# EAGLE schematic OpenPneu_ver2 (EAGLE 9.6.2)
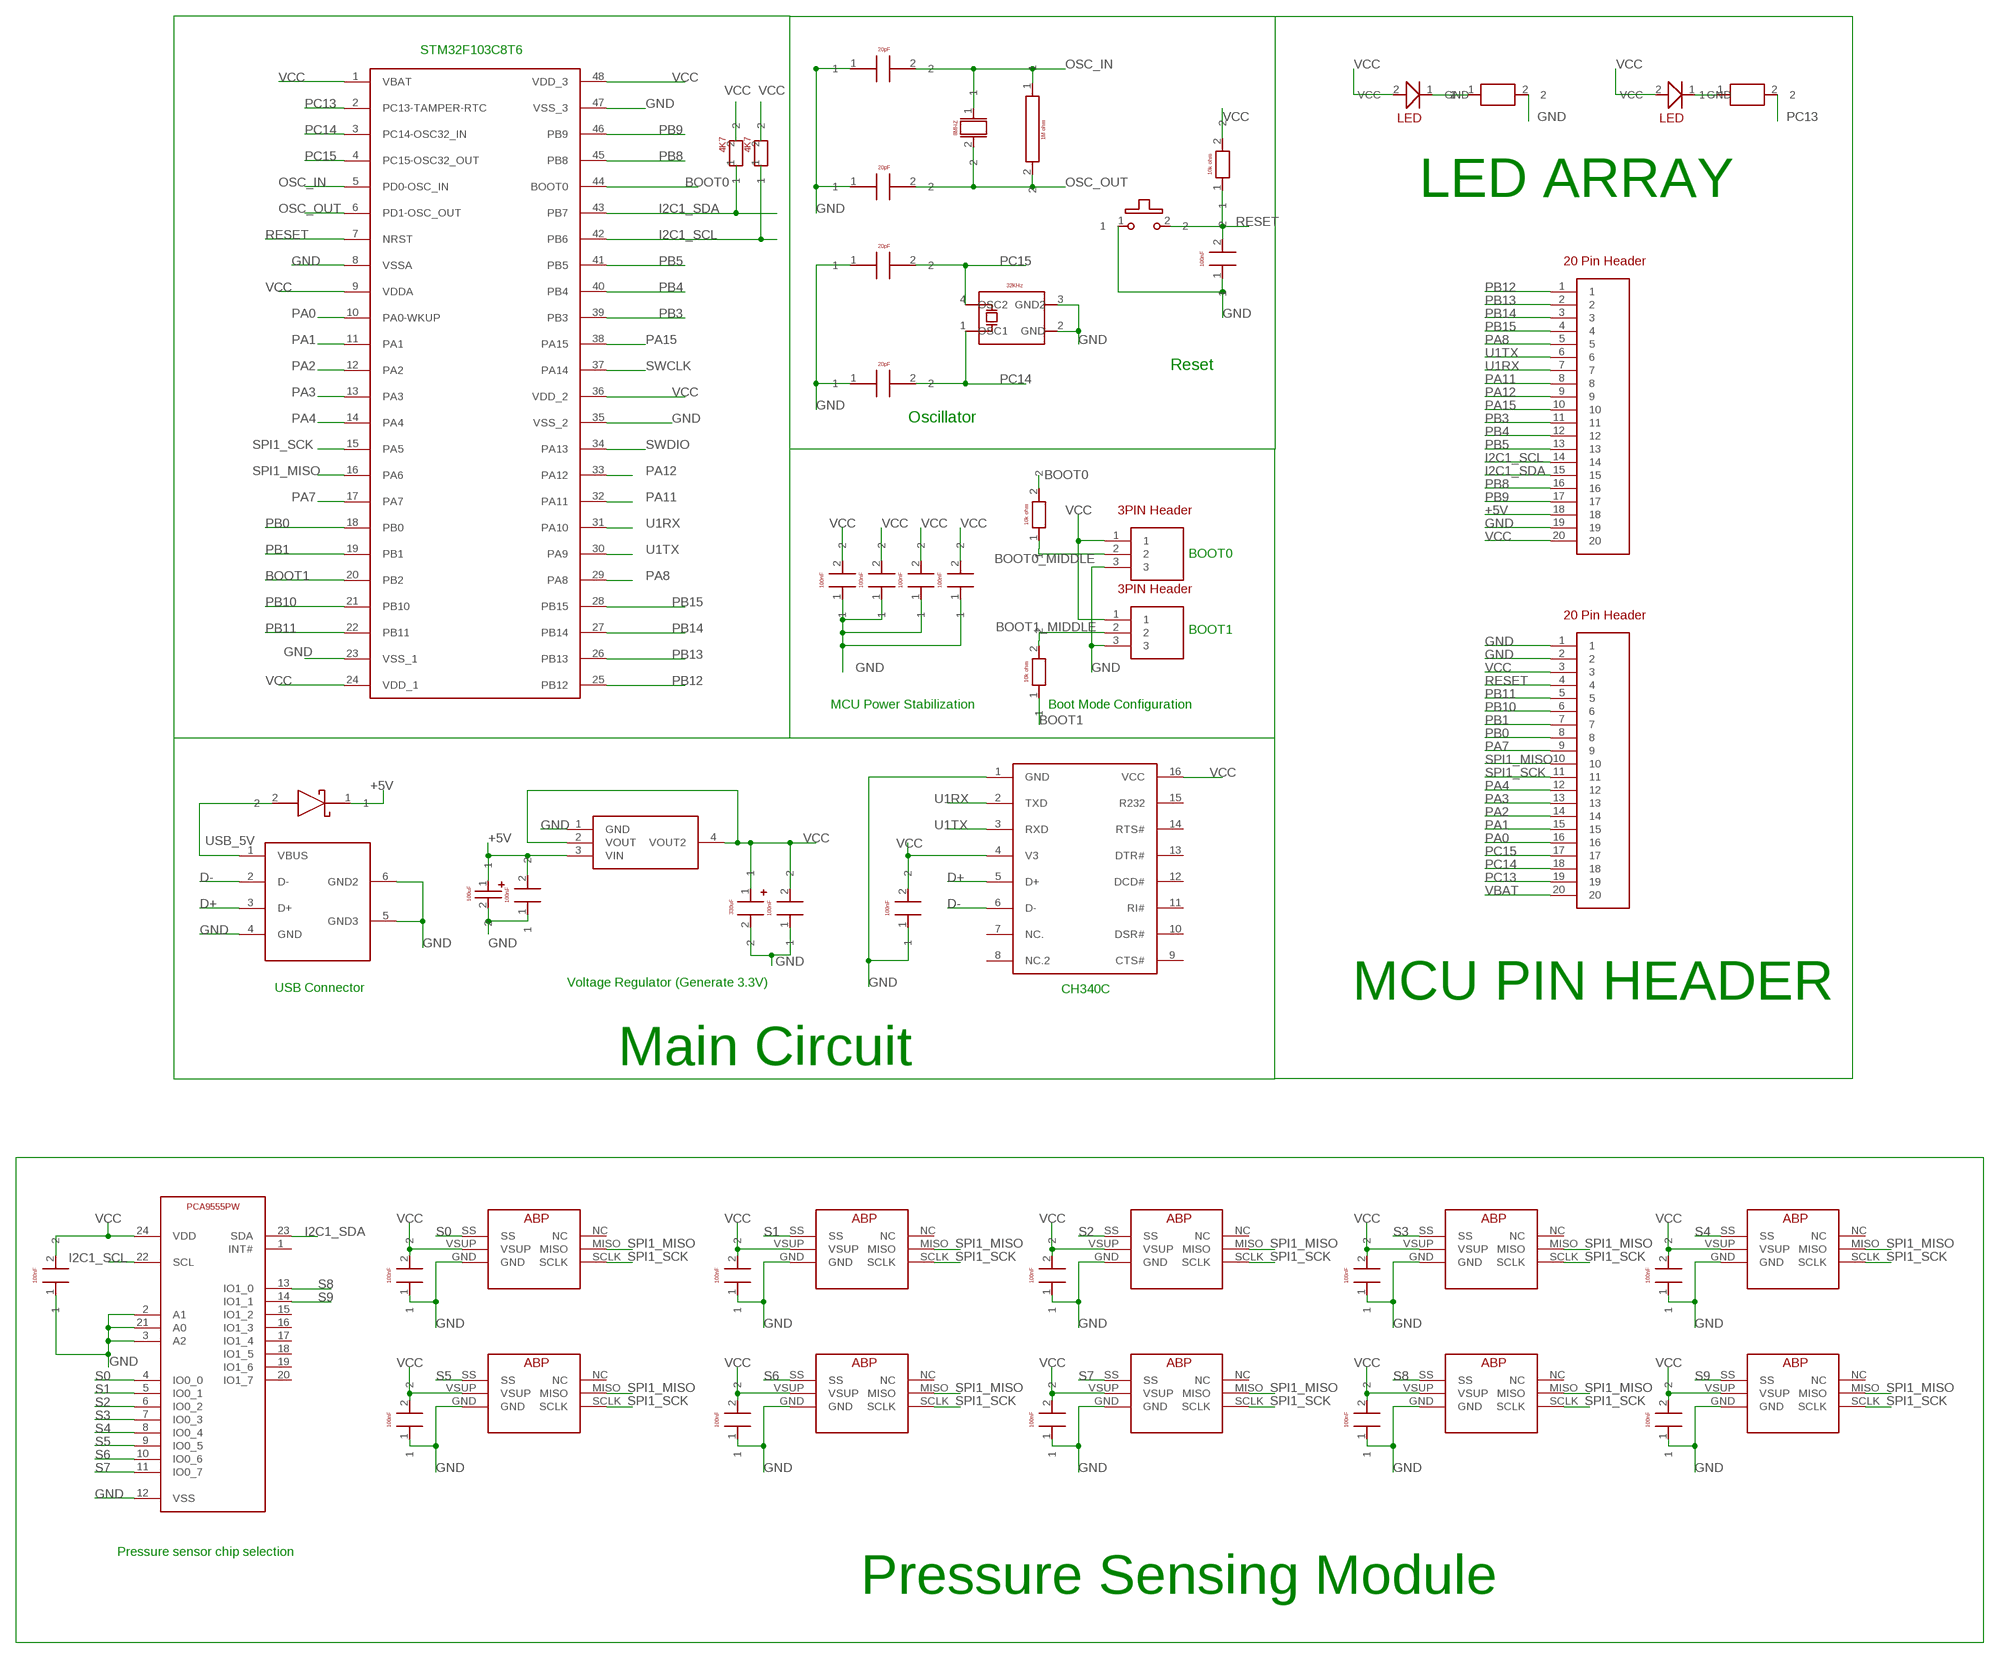
[diagram p0: schematic, sheet 1, part 1 of 3]
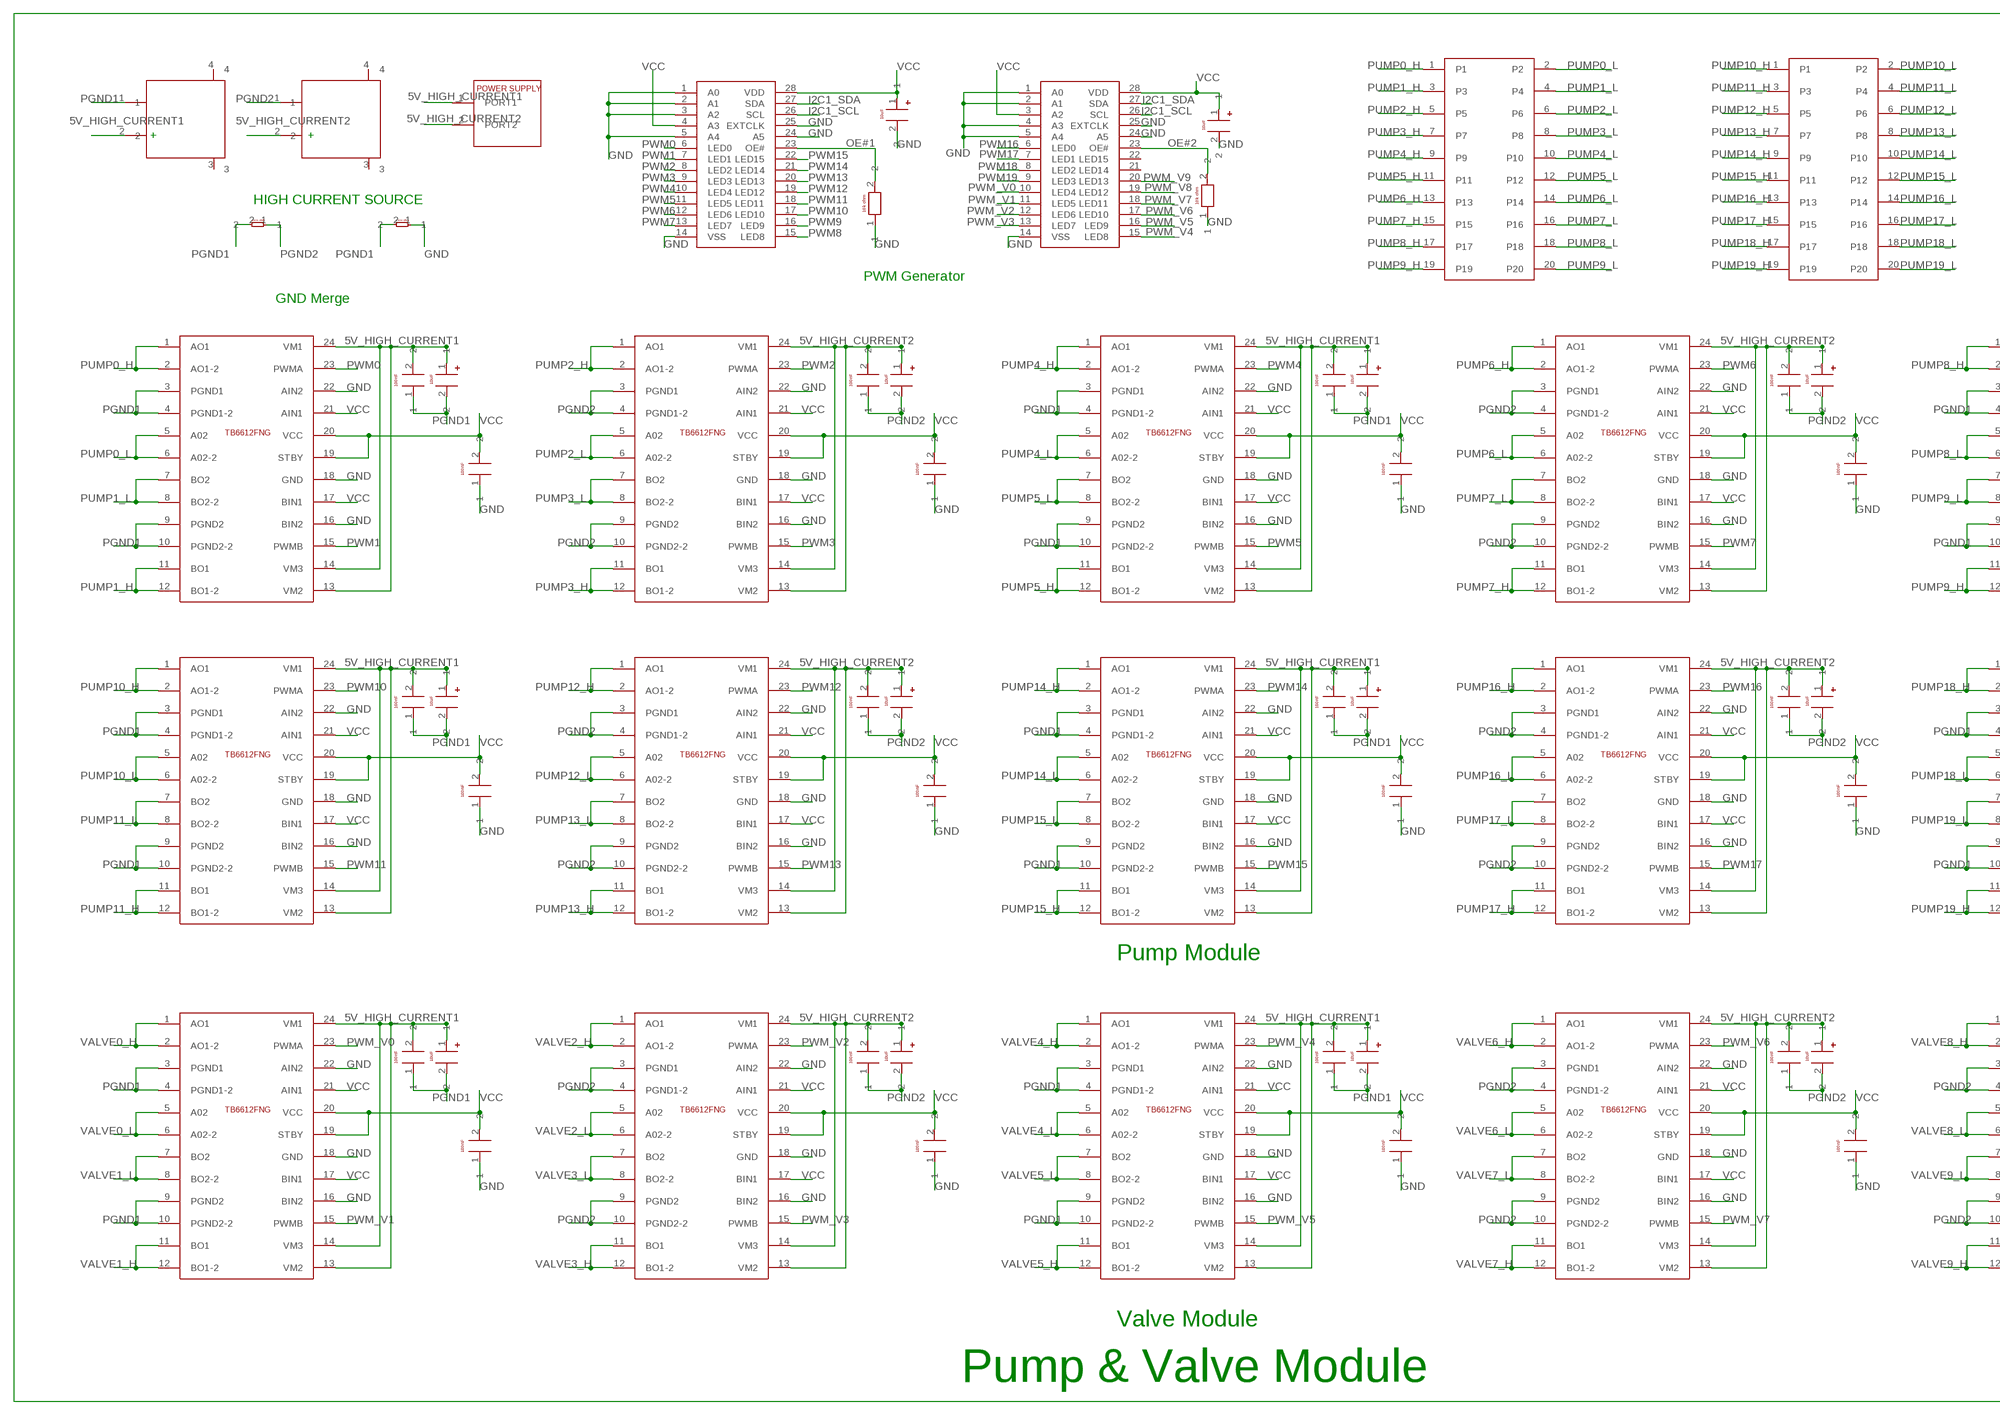
[diagram p1: schematic, sheet 1, part 2 of 3]
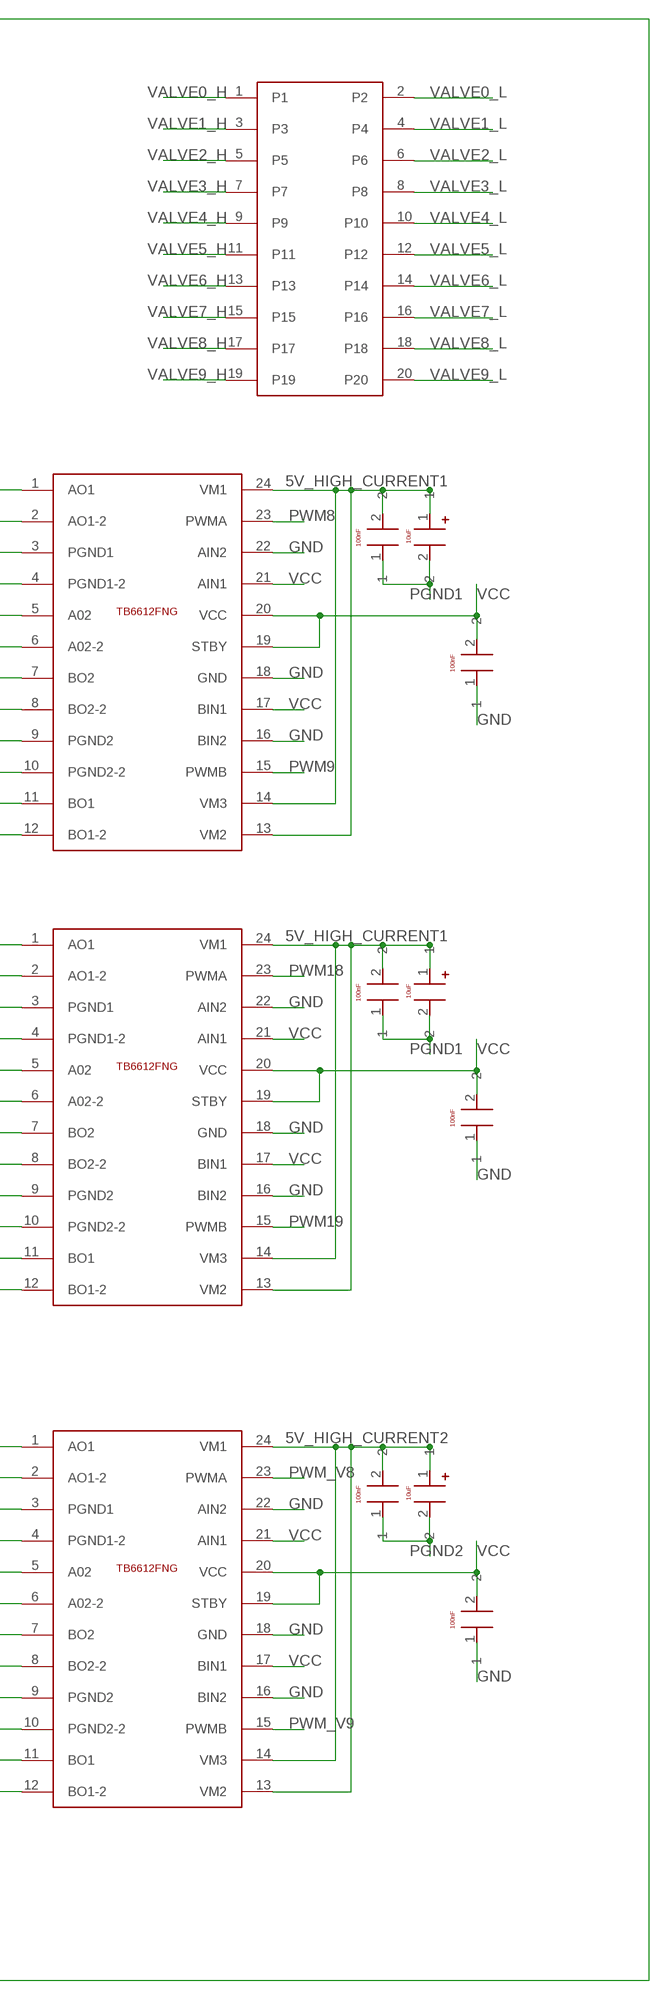
[diagram p2: schematic, sheet 1, part 3 of 3]

## Parts
J1  D01-9922046  [HDRV20W46P0X254_1X20_5090X254X]
J2  D01-9922046  [HDRV20W46P0X254_1X20_5090X254X]
U$1  STM32F103_DEVICE  [LQFP-48_L7.0-W7.0-P0.50-LS9.27PRIMARY]
U$2  8MHZ_DEVICE  [CRYSTAL-SMD_L11.5-W4.8-LS12.A9PRIMARY]
U$3  20PF_DEVICE  [C0603_1PRIMARY]
U$4  20PF_DEVICE  [C0603_1PRIMARY]
U$5  1M_DEVICE  [R0603_1PRIMARY]
U$6  32KHZ_DEVICE  [MC-306_4P-L8.0-W3.2-P5.5-BL_1PRIMARY]
U$7  20PF_DEVICE  [C0603_1PRIMARY]
U$8  20PF_DEVICE  [C0603_1PRIMARY]
U$9  VOLTAGE_REGULATOR  [SOT-223-3_L6.5-W3.4-P2.30-LS59PRIMARY]
U$10  100UF  [CAP-SMD_L6.0-W3.2-R-RD_1PRIMARY]
U$11  100NF_DEVICE  [C0603_1PRIMARY]
U$12  330UF_DEVICE  [CAP-SMD_L6.0-W3.2-R-RD_1PRIMARY]
U$13  100NF_DEVICE  [C0603_1PRIMARY]
U$14  100NF_DEVICE  [C0603_1PRIMARY]
U$15  100NF_DEVICE  [C0603_1PRIMARY]
U$16  100NF_DEVICE  [C0603_1PRIMARY]
U$17  100NF_DEVICE  [C0603_1PRIMARY]
U$18  USB_NORM_VER2_DEV  [USB-B-TH_USB-B01_1PRIMARY]
U$19  DIODE_DEVICE  [SMA_L4.4-W2.8-LS5.4-RD_1PRIMARY]
U$20  CH340C_DEVICE  [SOP-16_L10.0-W3.9-P1.27-LS6.C7PRIMARY]
U$21  100NF_DEVICE  [C0603_1PRIMARY]
U$22  3PIN_DEVICE  [HDRV20W46P0X254_1X20_5090X254X]
U$23  3PIN_DEVICE  [HDRV20W46P0X254_1X20_5090X254X]
U$24  10K_DEVICE  [R0603_1PRIMARY]
U$25  10K_DEVICE  [R0603_1PRIMARY]
U$26  BUTTON_DEVICE  [SW-SMD_SMK_JPM1040-XXXXFC_1PRIMARY]
U$27  POWER  [CONN-TH_P5.00_KF301-5.0-2P_1PRIMARY]
U$28  10K_DEVICE  [R0603_1PRIMARY]
U$29  PCA9685PCA9685  [TSSOP-28_L9.7-W4.4-P0.65-LS6FFPRIMARY]
U$30  PCA9685PCA9685  [TSSOP-28_L9.7-W4.4-P0.65-LS6FFPRIMARY]
U$31  10K_DEVICE  [R0603_1PRIMARY]
U$32  10UF_DEVICE  [CAP-SMD_L3.5-W2.8-R-RD_1PRIMARY]
U$33  10UF_DEVICE  [CAP-SMD_L3.5-W2.8-R-RD_1PRIMARY]
U$34  10K_DEVICE  [R0603_1PRIMARY]
U$35  TB6612FNG  [SSOP-24_L8.3-W5.6-P0.65-LS7.93PRIMARY]
U$36  TB6612FNG  [SSOP-24_L8.3-W5.6-P0.65-LS7.93PRIMARY]
U$37  100NF_DEVICE  [C0603_1PRIMARY]
U$38  10UF_DEVICE  [CAP-SMD_L3.5-W2.8-R-RD_1PRIMARY]
U$39  100NF_DEVICE  [C0603_1PRIMARY]
U$40  100NF_DEVICE  [C0603_1PRIMARY]
U$41  10UF_DEVICE  [CAP-SMD_L3.5-W2.8-R-RD_1PRIMARY]
U$42  100NF_DEVICE  [C0603_1PRIMARY]
U$43  TB6612FNG  [SSOP-24_L8.3-W5.6-P0.65-LS7.93PRIMARY]
U$44  100NF_DEVICE  [C0603_1PRIMARY]
U$45  10UF_DEVICE  [CAP-SMD_L3.5-W2.8-R-RD_1PRIMARY]
U$46  100NF_DEVICE  [C0603_1PRIMARY]
U$47  TB6612FNG  [SSOP-24_L8.3-W5.6-P0.65-LS7.93PRIMARY]
U$48  100NF_DEVICE  [C0603_1PRIMARY]
U$49  10UF_DEVICE  [CAP-SMD_L3.5-W2.8-R-RD_1PRIMARY]
U$50  100NF_DEVICE  [C0603_1PRIMARY]
U$51  TB6612FNG  [SSOP-24_L8.3-W5.6-P0.65-LS7.93PRIMARY]
U$52  100NF_DEVICE  [C0603_1PRIMARY]
U$53  10UF_DEVICE  [CAP-SMD_L3.5-W2.8-R-RD_1PRIMARY]
U$54  100NF_DEVICE  [C0603_1PRIMARY]
U$55  TB6612FNG  [SSOP-24_L8.3-W5.6-P0.65-LS7.93PRIMARY]
U$56  100NF_DEVICE  [C0603_1PRIMARY]
U$57  10UF_DEVICE  [CAP-SMD_L3.5-W2.8-R-RD_1PRIMARY]
U$58  100NF_DEVICE  [C0603_1PRIMARY]
U$59  TB6612FNG  [SSOP-24_L8.3-W5.6-P0.65-LS7.93PRIMARY]
U$60  100NF_DEVICE  [C0603_1PRIMARY]
U$61  10UF_DEVICE  [CAP-SMD_L3.5-W2.8-R-RD_1PRIMARY]
U$62  100NF_DEVICE  [C0603_1PRIMARY]
U$63  TB6612FNG  [SSOP-24_L8.3-W5.6-P0.65-LS7.93PRIMARY]
U$64  100NF_DEVICE  [C0603_1PRIMARY]
U$65  10UF_DEVICE  [CAP-SMD_L3.5-W2.8-R-RD_1PRIMARY]
U$66  100NF_DEVICE  [C0603_1PRIMARY]
U$67  TB6612FNG  [SSOP-24_L8.3-W5.6-P0.65-LS7.93PRIMARY]
U$68  100NF_DEVICE  [C0603_1PRIMARY]
U$69  10UF_DEVICE  [CAP-SMD_L3.5-W2.8-R-RD_1PRIMARY]
U$70  100NF_DEVICE  [C0603_1PRIMARY]
U$71  TB6612FNG  [SSOP-24_L8.3-W5.6-P0.65-LS7.93PRIMARY]
U$72  100NF_DEVICE  [C0603_1PRIMARY]
U$73  10UF_DEVICE  [CAP-SMD_L3.5-W2.8-R-RD_1PRIMARY]
U$74  100NF_DEVICE  [C0603_1PRIMARY]
U$75  TB6612FNG  [SSOP-24_L8.3-W5.6-P0.65-LS7.93PRIMARY]
U$76  100NF_DEVICE  [C0603_1PRIMARY]
U$77  10UF_DEVICE  [CAP-SMD_L3.5-W2.8-R-RD_1PRIMARY]
U$78  100NF_DEVICE  [C0603_1PRIMARY]
U$79  TB6612FNG  [SSOP-24_L8.3-W5.6-P0.65-LS7.93PRIMARY]
U$80  100NF_DEVICE  [C0603_1PRIMARY]
U$81  10UF_DEVICE  [CAP-SMD_L3.5-W2.8-R-RD_1PRIMARY]
U$82  100NF_DEVICE  [C0603_1PRIMARY]
U$83  TB6612FNG  [SSOP-24_L8.3-W5.6-P0.65-LS7.93PRIMARY]
U$84  100NF_DEVICE  [C0603_1PRIMARY]
U$85  10UF_DEVICE  [CAP-SMD_L3.5-W2.8-R-RD_1PRIMARY]
U$86  100NF_DEVICE  [C0603_1PRIMARY]
U$87  TB6612FNG  [SSOP-24_L8.3-W5.6-P0.65-LS7.93PRIMARY]
U$88  100NF_DEVICE  [C0603_1PRIMARY]
U$89  10UF_DEVICE  [CAP-SMD_L3.5-W2.8-R-RD_1PRIMARY]
U$90  100NF_DEVICE  [C0603_1PRIMARY]
U$91  TB6612FNG  [SSOP-24_L8.3-W5.6-P0.65-LS7.93PRIMARY]
U$92  100NF_DEVICE  [C0603_1PRIMARY]
U$93  10UF_DEVICE  [CAP-SMD_L3.5-W2.8-R-RD_1PRIMARY]
U$94  100NF_DEVICE  [C0603_1PRIMARY]
U$95  ABPDANN1.6BGSA  [ABPDANN1.6BGSA]
U$96  ABPDANN1.6BGSA  [ABPDANN1.6BGSA]
U$97  100NF_DEVICE  [C0603_1PRIMARY]
U$98  100NF_DEVICE  [C0603_1PRIMARY]
U$99  ABPDANN1.6BGSA  [ABPDANN1.6BGSA]
U$100  100NF_DEVICE  [C0603_1PRIMARY]
U$101  ABPDANN1.6BGSA  [ABPDANN1.6BGSA]
U$102  100NF_DEVICE  [C0603_1PRIMARY]
U$103  ABPDANN1.6BGSA  [ABPDANN1.6BGSA]
U$104  100NF_DEVICE  [C0603_1PRIMARY]
U$105  ABPDANN1.6BGSA  [ABPDANN1.6BGSA]
U$106  100NF_DEVICE  [C0603_1PRIMARY]
U$107  ABPDANN1.6BGSA  [ABPDANN1.6BGSA]
U$108  100NF_DEVICE  [C0603_1PRIMARY]
U$109  ABPDANN1.6BGSA  [ABPDANN1.6BGSA]
U$110  100NF_DEVICE  [C0603_1PRIMARY]
U$111  ABPDANN1.6BGSA  [ABPDANN1.6BGSA]
U$112  100NF_DEVICE  [C0603_1PRIMARY]
U$113  ABPDANN1.6BGSA  [ABPDANN1.6BGSA]
U$114  100NF_DEVICE  [C0603_1PRIMARY]
U$115  TSSOP-24_L7.8-W4.4-P0.65-LS652  [TSSOP-24_L7.8-W4.4-P0.65-LS652PRIMARY]
U$116  100NF_DEVICE  [C0603_1PRIMARY]
U$117  XT60_DEVICE  [CONN-TH_XT60PW-M_1PRIMARY]
U$118  XT60_DEVICE  [CONN-TH_XT60PW-M_1PRIMARY]
U$119  ZERO_OHM  [ZERO_OHM_FOOT]
U$120  ZERO_OHM  [ZERO_OHM_FOOT]
U$121  PHB-2-10  [CONN-TH_PHB-2-10A_1PRIMARY]
U$122  PHB-2-10  [CONN-TH_PHB-2-10A_1PRIMARY]
U$123  PHB-2-10  [CONN-TH_PHB-2-10A_1PRIMARY]
U$124  LED  [LED0603-RD_1PRIMARY]
U$125  LED  [LED0603-RD_1PRIMARY]
U$126  510_OHM_DEVICE  [R0603_1PRIMARY]
U$127  510_OHM_DEVICE  [R0603_1PRIMARY]
U$128  4K7  [4K7]
U$129  4K7  [4K7]
U$130  100NF_DEVICE  [C0603_1PRIMARY]

## Nets
5V_HIGH_CURRENT1: U$27.1(PORT1) U$35.13(VM2) U$35.14(VM3) U$35.24(VM1) U$37.2 U$38.1 U$43.13(VM2) U$43.14(VM3) U$43.24(VM1) U$44.2 U$45.1 U$51.13(VM2) U$51.14(VM3) U$51.24(VM1) U$52.2 U$53.1 U$55.13(VM2) U$55.14(VM3) U$55.24(VM1) U$56.2 U$57.1 U$63.13(VM2) U$63.14(VM3) U$63.24(VM1) U$64.2 U$65.1 U$71.13(VM2) U$71.14(VM3) U$71.24(VM1) U$72.2 U$73.1 U$75.13(VM2) U$75.14(VM3) U$75.24(VM1) U$76.2 U$77.1 U$83.13(VM2) U$83.14(VM3) U$83.24(VM1) U$84.2 U$85.1 U$117.2
5V_HIGH_CURRENT2: U$27.2(PORT2) U$36.13(VM2) U$36.14(VM3) U$36.24(VM1) U$40.2 U$41.1 U$47.13(VM2) U$47.14(VM3) U$47.24(VM1) U$48.2 U$49.1 U$59.13(VM2) U$59.14(VM3) U$59.24(VM1) U$60.2 U$61.1 U$67.13(VM2) U$67.14(VM3) U$67.24(VM1) U$68.2 U$69.1 U$79.13(VM2) U$79.14(VM3) U$79.24(VM1) U$80.2 U$81.1 U$87.13(VM2) U$87.14(VM3) U$87.24(VM1) U$88.2 U$89.1 U$91.13(VM2) U$91.14(VM3) U$91.24(VM1) U$92.2 U$93.1 U$118.2
+5V: J1.18 U$9.3(VIN) U$10.1 U$11.2 U$19.1
BOOT0: U$1.44(BOOT0) U$24.2
BOOT0_MIDDLE: U$22.2 U$24.1
BOOT1: U$1.20(PB2) U$25.1
BOOT1_MIDDLE: U$23.2 U$25.2
D+: U$18.3(D+) U$20.5(D+)
D-: U$18.2(D-) U$20.6(D-)
GND: J1.19 J2.1 J2.2 U$1.8(VSSA) U$1.23(VSS_1) U$1.35(VSS_2) U$1.47(VSS_3) U$3.1 U$4.1 U$6.2(GND) U$6.3(GND2) U$7.1 U$8.1 U$9.1(GND) U$10.2 U$11.1 U$12.2 U$13.1 U$14.1 U$15.1 U$16.1 U$17.1 U$18.4(GND) U$18.5(GND3) U$18.6(GND2) U$20.1(GND) U$21.1 U$22.3 U$23.3 U$26.1 U$29.1(A0) U$29.2(A1) U$29.3(A2) U$29.5(A4) U$29.14(VSS) U$29.24(A5) U$29.25(EXTCLK) U$30.1(A0) U$30.2(A1) U$30.4(A3) U$30.5(A4) U$30.14(VSS) U$30.24(A5) U$30.25(EXTCLK) U$31.1 U$32.2 U$33.2 U$34.1 U$35.16(BIN2) U$35.18(GND) U$35.22(AIN2) U$36.16(BIN2) U$36.18(GND) U$36.22(AIN2) U$39.1 U$42.1 U$43.16(BIN2) U$43.18(GND) U$43.22(AIN2) U$46.1 U$47.16(BIN2) U$47.18(GND) U$47.22(AIN2) U$50.1 U$51.16(BIN2) U$51.18(GND) U$51.22(AIN2) U$54.1 U$55.16(BIN2) U$55.18(GND) U$55.22(AIN2) U$58.1 U$59.16(BIN2) U$59.18(GND) U$59.22(AIN2) U$62.1 U$63.16(BIN2) U$63.18(GND) U$63.22(AIN2) U$66.1 U$67.16(BIN2) U$67.18(GND) U$67.22(AIN2) U$70.1 U$71.16(BIN2) U$71.18(GND) U$71.22(AIN2) U$74.1 U$75.16(BIN2) U$75.18(GND) U$75.22(AIN2) U$78.1 U$79.16(BIN2) U$79.18(GND) U$79.22(AIN2) U$82.1 U$83.16(BIN2) U$83.18(GND) U$83.22(AIN2) U$86.1 U$87.16(BIN2) U$87.18(GND) U$87.22(AIN2) U$90.1 U$91.16(BIN2) U$91.18(GND) U$91.22(AIN2) U$94.1 U$95.GND U$96.GND U$97.1 U$98.1 U$99.GND U$100.1 U$101.GND U$102.1 U$103.GND U$104.1 U$105.GND U$106.1 U$107.GND U$108.1 U$109.GND U$110.1 U$111.GND U$112.1 U$113.GND U$114.1 U$115.2(A1) U$115.3(A2) U$115.12(VSS) U$115.21(A0) U$116.1 U$120.1 U$126.2 U$130.1
I2C1_SCL: J1.14 U$1.42(PB6) U$29.26(SCL) U$30.26(SCL) U$115.22(SCL) U$129.1
I2C1_SDA: J1.15 U$1.43(PB7) U$29.27(SDA) U$30.27(SDA) U$115.23(SDA) U$128.1
N$7: U$124.1(GND) U$126.1
N$9: U$125.1(GND) U$127.1
OE#1: U$29.23(OE#) U$31.2
OE#2: U$30.23(OE#) U$34.2
OSC_IN: U$1.5(PD0-OSC_IN) U$2.1 U$3.2 U$5.1
OSC_OUT: U$1.6(PD1-OSC_OUT) U$2.2 U$4.2 U$5.2
PA0: J2.16 U$1.10(PA0-WKUP)
PA1: J2.15 U$1.11(PA1)
PA2: J2.14 U$1.12(PA2)
PA3: J2.13 U$1.13(PA3)
PA4: J2.12 U$1.14(PA4)
PA7: J2.9 U$1.17(PA7)
PA8: J1.5 U$1.29(PA8)
PA11: J1.8 U$1.32(PA11)
PA12: J1.9 U$1.33(PA12)
PA15: J1.10 U$1.38(PA15)
PB0: J2.8 U$1.18(PB0)
PB1: J2.7 U$1.19(PB1)
PB3: J1.11 U$1.39(PB3)
PB4: J1.12 U$1.40(PB4)
PB5: J1.13 U$1.41(PB5)
PB8: J1.16 U$1.45(PB8)
PB9: J1.17 U$1.46(PB9)
PB10: J2.6 U$1.21(PB10)
PB11: J2.5 U$1.22(PB11)
PB12: J1.1 U$1.25(PB12)
PB13: J1.2 U$1.26(PB13)
PB14: J1.3 U$1.27(PB14)
PB15: J1.4 U$1.28(PB15)
PC13: J2.19 U$1.2(PC13-TAMPER-RTC) U$127.2
PC14: J2.18 U$1.3(PC14-OSC32_IN) U$6.1(OSC1) U$8.2
PC15: J2.17 U$1.4(PC15-OSC32_OUT) U$6.4(OSC2) U$7.2
PGND1: U$35.3(PGND1) U$35.4(PGND1-2) U$35.9(PGND2) U$35.10(PGND2-2) U$37.1 U$38.2 U$43.3(PGND1) U$43.4(PGND1-2) U$43.9(PGND2) U$43.10(PGND2-2) U$44.1 U$45.2 U$51.3(PGND1) U$51.4(PGND1-2) U$51.9(PGND2) U$51.10(PGND2-2) U$52.1 U$53.2 U$55.3(PGND1) U$55.4(PGND1-2) U$55.9(PGND2) U$55.10(PGND2-2) U$56.1 U$57.2 U$63.3(PGND1) U$63.4(PGND1-2) U$63.9(PGND2) U$63.10(PGND2-2) U$64.1 U$65.2 U$71.3(PGND1) U$71.4(PGND1-2) U$71.9(PGND2) U$71.10(PGND2-2) U$72.1 U$73.2 U$75.3(PGND1) U$75.4(PGND1-2) U$75.9(PGND2) U$75.10(PGND2-2) U$76.1 U$77.2 U$83.3(PGND1) U$83.4(PGND1-2) U$83.9(PGND2) U$83.10(PGND2-2) U$84.1 U$85.2 U$117.1 U$119.2 U$120.2
PGND2: U$36.3(PGND1) U$36.4(PGND1-2) U$36.9(PGND2) U$36.10(PGND2-2) U$40.1 U$41.2 U$47.3(PGND1) U$47.4(PGND1-2) U$47.9(PGND2) U$47.10(PGND2-2) U$48.1 U$49.2 U$59.3(PGND1) U$59.4(PGND1-2) U$59.9(PGND2) U$59.10(PGND2-2) U$60.1 U$61.2 U$67.3(PGND1) U$67.4(PGND1-2) U$67.9(PGND2) U$67.10(PGND2-2) U$68.1 U$69.2 U$79.3(PGND1) U$79.4(PGND1-2) U$79.9(PGND2) U$79.10(PGND2-2) U$80.1 U$81.2 U$87.3(PGND1) U$87.4(PGND1-2) U$87.9(PGND2) U$87.10(PGND2-2) U$88.1 U$89.2 U$91.3(PGND1) U$91.4(PGND1-2) U$91.9(PGND2) U$91.10(PGND2-2) U$92.1 U$93.2 U$118.1 U$119.1
PUMP0_H: U$35.1(AO1) U$35.2(AO1-2) U$121.1
PUMP0_L: U$35.5(A02) U$35.6(A02-2) U$121.2
PUMP1_H: U$35.11(BO1) U$35.12(BO1-2) U$121.3
PUMP1_L: U$35.7(BO2) U$35.8(BO2-2) U$121.4
PUMP2_H: U$36.1(AO1) U$36.2(AO1-2) U$121.5
PUMP2_L: U$36.5(A02) U$36.6(A02-2) U$121.6
PUMP3_H: U$36.11(BO1) U$36.12(BO1-2) U$121.7
PUMP3_L: U$36.7(BO2) U$36.8(BO2-2) U$121.8
PUMP4_H: U$43.1(AO1) U$43.2(AO1-2) U$121.9
PUMP4_L: U$43.5(A02) U$43.6(A02-2) U$121.10
PUMP5_H: U$43.11(BO1) U$43.12(BO1-2) U$121.11
PUMP5_L: U$43.7(BO2) U$43.8(BO2-2) U$121.12
PUMP6_H: U$47.1(AO1) U$47.2(AO1-2) U$121.13
PUMP6_L: U$47.5(A02) U$47.6(A02-2) U$121.14
PUMP7_H: U$47.11(BO1) U$47.12(BO1-2) U$121.15
PUMP7_L: U$47.7(BO2) U$47.8(BO2-2) U$121.16
PUMP8_H: U$51.1(AO1) U$51.2(AO1-2) U$121.17
PUMP8_L: U$51.5(A02) U$51.6(A02-2) U$121.18
PUMP9_H: U$51.11(BO1) U$51.12(BO1-2) U$121.19
PUMP9_L: U$51.7(BO2) U$51.8(BO2-2) U$121.20
PUMP10_H: U$55.1(AO1) U$55.2(AO1-2) U$122.1
PUMP10_L: U$55.5(A02) U$55.6(A02-2) U$122.2
PUMP11_H: U$55.11(BO1) U$55.12(BO1-2) U$122.3
PUMP11_L: U$55.7(BO2) U$55.8(BO2-2) U$122.4
PUMP12_H: U$59.1(AO1) U$59.2(AO1-2) U$122.5
PUMP12_L: U$59.5(A02) U$59.6(A02-2) U$122.6
PUMP13_H: U$59.11(BO1) U$59.12(BO1-2) U$122.7
PUMP13_L: U$59.7(BO2) U$59.8(BO2-2) U$122.8
PUMP14_H: U$63.1(AO1) U$63.2(AO1-2) U$122.9
PUMP14_L: U$63.5(A02) U$63.6(A02-2) U$122.10
PUMP15_H: U$63.11(BO1) U$63.12(BO1-2) U$122.11
PUMP15_L: U$63.7(BO2) U$63.8(BO2-2) U$122.12
PUMP16_H: U$67.1(AO1) U$67.2(AO1-2) U$122.13
PUMP16_L: U$67.5(A02) U$67.6(A02-2) U$122.14
PUMP17_H: U$67.11(BO1) U$67.12(BO1-2) U$122.15
PUMP17_L: U$67.7(BO2) U$67.8(BO2-2) U$122.16
PUMP18_H: U$71.1(AO1) U$71.2(AO1-2) U$122.17
PUMP18_L: U$71.5(A02) U$71.6(A02-2) U$122.18
PUMP19_H: U$71.11(BO1) U$71.12(BO1-2) U$122.19
PUMP19_L: U$71.7(BO2) U$71.8(BO2-2) U$122.20
PWM0: U$29.6(LED0) U$35.23(PWMA)
PWM1: U$29.7(LED1) U$35.15(PWMB)
PWM2: U$29.8(LED2) U$36.23(PWMA)
PWM3: U$29.9(LED3) U$36.15(PWMB)
PWM4: U$29.10(LED4) U$43.23(PWMA)
PWM5: U$29.11(LED5) U$43.15(PWMB)
PWM6: U$29.12(LED6) U$47.23(PWMA)
PWM7: U$29.13(LED7) U$47.15(PWMB)
PWM8: U$29.15(LED8) U$51.23(PWMA)
PWM9: U$29.16(LED9) U$51.15(PWMB)
PWM10: U$29.17(LED10) U$55.23(PWMA)
PWM11: U$29.18(LED11) U$55.15(PWMB)
PWM12: U$29.19(LED12) U$59.23(PWMA)
PWM13: U$29.20(LED13) U$59.15(PWMB)
PWM14: U$29.21(LED14) U$63.23(PWMA)
PWM15: U$29.22(LED15) U$63.15(PWMB)
PWM16: U$30.6(LED0) U$67.23(PWMA)
PWM17: U$30.7(LED1) U$67.15(PWMB)
PWM18: U$30.8(LED2) U$71.23(PWMA)
PWM19: U$30.9(LED3) U$71.15(PWMB)
PWM_V0: U$30.10(LED4) U$75.23(PWMA)
PWM_V1: U$30.11(LED5) U$75.15(PWMB)
PWM_V2: U$30.12(LED6) U$79.23(PWMA)
PWM_V3: U$30.13(LED7) U$79.15(PWMB)
PWM_V4: U$30.15(LED8) U$83.23(PWMA)
PWM_V5: U$30.16(LED9) U$83.15(PWMB)
PWM_V6: U$30.17(LED10) U$87.23(PWMA)
PWM_V7: U$30.18(LED11) U$87.15(PWMB)
PWM_V8: U$30.19(LED12) U$91.23(PWMA)
PWM_V9: U$30.20(LED13) U$91.15(PWMB)
RESET: J2.4 U$1.7(NRST) U$26.2 U$28.1 U$130.2
S0: U$95.SS U$115.4(IO0_0)
S1: U$96.SS U$115.5(IO0_1)
S2: U$99.SS U$115.6(IO0_2)
S3: U$101.SS U$115.7(IO0_3)
S4: U$103.SS U$115.8(IO0_4)
S5: U$105.SS U$115.9(IO0_5)
S6: U$107.SS U$115.10(IO0_6)
S7: U$109.SS U$115.11(IO0_7)
S8: U$111.SS U$115.13(IO1_0)
S9: U$113.SS U$115.14(IO1_1)
SPI1_MISO: J2.10 U$1.16(PA6) U$95.MISO U$96.MISO U$99.MISO U$101.MISO U$103.MISO U$105.MISO U$107.MISO U$109.MISO U$111.MISO U$113.MISO
SPI1_SCK: J2.11 U$1.15(PA5) U$95.SCLK U$96.SCLK U$99.SCLK U$101.SCLK U$103.SCLK U$105.SCLK U$107.SCLK U$109.SCLK U$111.SCLK U$113.SCLK
SWCLK: U$1.37(PA14)
SWDIO: U$1.34(PA13)
U1RX: J1.7 U$1.31(PA10) U$20.2(TXD)
U1TX: J1.6 U$1.30(PA9) U$20.3(RXD)
USB_5V: U$18.1(VBUS) U$19.2
VALVE0_H: U$75.1(AO1) U$75.2(AO1-2) U$123.1
VALVE0_L: U$75.5(A02) U$75.6(A02-2) U$123.2
VALVE1_H: U$75.11(BO1) U$75.12(BO1-2) U$123.3
VALVE1_L: U$75.7(BO2) U$75.8(BO2-2) U$123.4
VALVE2_H: U$79.1(AO1) U$79.2(AO1-2) U$123.5
VALVE2_L: U$79.5(A02) U$79.6(A02-2) U$123.6
VALVE3_H: U$79.11(BO1) U$79.12(BO1-2) U$123.7
VALVE3_L: U$79.7(BO2) U$79.8(BO2-2) U$123.8
VALVE4_H: U$83.1(AO1) U$83.2(AO1-2) U$123.9
VALVE4_L: U$83.5(A02) U$83.6(A02-2) U$123.10
VALVE5_H: U$83.11(BO1) U$83.12(BO1-2) U$123.11
VALVE5_L: U$83.7(BO2) U$83.8(BO2-2) U$123.12
VALVE6_H: U$87.1(AO1) U$87.2(AO1-2) U$123.13
VALVE6_L: U$87.5(A02) U$87.6(A02-2) U$123.14
VALVE7_H: U$87.11(BO1) U$87.12(BO1-2) U$123.15
VALVE7_L: U$87.7(BO2) U$87.8(BO2-2) U$123.16
VALVE8_H: U$91.1(AO1) U$91.2(AO1-2) U$123.17
VALVE8_L: U$91.5(A02) U$91.6(A02-2) U$123.18
VALVE9_H: U$91.11(BO1) U$91.12(BO1-2) U$123.19
VALVE9_L: U$91.7(BO2) U$91.8(BO2-2) U$123.20
VBAT: J2.20
VCC: J1.20 J2.3 U$1.1(VBAT) U$1.9(VDDA) U$1.24(VDD_1) U$1.36(VDD_2) U$1.48(VDD_3) U$9.2(VOUT) U$9.4(VOUT2) U$12.1 U$13.2 U$14.2 U$15.2 U$16.2 U$17.2 U$20.4(V3) U$20.16(VCC) U$21.2 U$22.1 U$23.1 U$28.2 U$29.4(A3) U$29.28(VDD) U$30.3(A2) U$30.28(VDD) U$32.1 U$33.1 U$35.17(BIN1) U$35.19(STBY) U$35.20(VCC) U$35.21(AIN1) U$36.17(BIN1) U$36.19(STBY) U$36.20(VCC) U$36.21(AIN1) U$39.2 U$42.2 U$43.17(BIN1) U$43.19(STBY) U$43.20(VCC) U$43.21(AIN1) U$46.2 U$47.17(BIN1) U$47.19(STBY) U$47.20(VCC) U$47.21(AIN1) U$50.2 U$51.17(BIN1) U$51.19(STBY) U$51.20(VCC) U$51.21(AIN1) U$54.2 U$55.17(BIN1) U$55.19(STBY) U$55.20(VCC) U$55.21(AIN1) U$58.2 U$59.17(BIN1) U$59.19(STBY) U$59.20(VCC) U$59.21(AIN1) U$62.2 U$63.17(BIN1) U$63.19(STBY) U$63.20(VCC) U$63.21(AIN1) U$66.2 U$67.17(BIN1) U$67.19(STBY) U$67.20(VCC) U$67.21(AIN1) U$70.2 U$71.17(BIN1) U$71.19(STBY) U$71.20(VCC) U$71.21(AIN1) U$74.2 U$75.17(BIN1) U$75.19(STBY) U$75.20(VCC) U$75.21(AIN1) U$78.2 U$79.17(BIN1) U$79.19(STBY) U$79.20(VCC) U$79.21(AIN1) U$82.2 U$83.17(BIN1) U$83.19(STBY) U$83.20(VCC) U$83.21(AIN1) U$86.2 U$87.17(BIN1) U$87.19(STBY) U$87.20(VCC) U$87.21(AIN1) U$90.2 U$91.17(BIN1) U$91.19(STBY) U$91.20(VCC) U$91.21(AIN1) U$94.2 U$95.VSUP U$96.VSUP U$97.2 U$98.2 U$99.VSUP U$100.2 U$101.VSUP U$102.2 U$103.VSUP U$104.2 U$105.VSUP U$106.2 U$107.VSUP U$108.2 U$109.VSUP U$110.2 U$111.VSUP U$112.2 U$113.VSUP U$114.2 U$115.24(VDD) U$116.2 U$124.2(VCC) U$125.2(VCC) U$128.2 U$129.2
Unconnected: U$20.7(NC.) U$20.8(NC.2) U$20.9(CTS#) U$20.10(DSR#) U$20.11(RI#) U$20.12(DCD#) U$20.13(DTR#) U$20.14(RTS#) U$20.15(R232) U$30.21(LED14) U$30.22(LED15) U$95.NC U$96.NC U$99.NC U$101.NC U$103.NC U$105.NC U$107.NC U$109.NC U$111.NC U$113.NC U$115.1(INT#) U$115.15(IO1_2) U$115.16(IO1_3) U$115.17(IO1_4) U$115.18(IO1_5) U$115.19(IO1_6) U$115.20(IO1_7) U$117.3 U$117.4 U$118.3 U$118.4

## Notes on the sheet
- STM32F103C8T6
- + | +
- LED ARRAY
- HIGH CURRENT SOURCE
- PWM Generator
- GND Merge
- Reset
- Oscillator
- BOOT0
- BOOT1
- MCU Power Stabilization | Boot Mode Configuration
- Voltage Regulator (Generate 3.3V)
- USB Connector | CH340C
- MCU PIN HEADER
- Main Circuit
- Pump Module
- Pressure sensor chip selection | Valve Module
- Pressure Sensing Module
- Pump & Valve Module

## Library data of the parts
J1 J2 = 20PIN:D01-9922046: HARWIN D01-99 Series, 2.54mm Pitch 20 Way 1 Row Straight Pin Header, Through Hole, Solder Termination Source: Datasheet <http://uk.rs-online.com/web/p/products/5473302>; DESCRIPTION: HARWIN D01-99 Series, 2.54mm Pitch 20 Way 1 Row Straight Pin Header, Through Hole, Solder Termination; HEIGHT: 7.9mm; MANUFACTURER_NAME: Harwin; MANUFACTURER_PART_NUMBER: D01-9922046; RS_PART_NUMBER: 5473302; RS_PRICE-STOCK: http://uk.rs-online.com/web/p/products/5473302
U$1 = stm32f103c8t6:STM32F103_DEVICE
U$2 = 8MHZ_jlc:8MHZ_DEVICE
U$3 U$4 U$7 U$8 = 20pF:20PF_DEVICE
U$5 = 1M_ohm:1M_DEVICE
U$6 = 32khz_jlc:32KHZ_DEVICE
U$9 = AMS1117-3v3:VOLTAGE_REGULATOR
U$10 = 100uF:100UF
U$11 U$13-U$17 U$21 U$37 U$39 U$40 U$42 U$44 U$46 U$48 U$50 U$52 U$54 U$56 U$58 U$60 U$62 U$64 U$66 U$68 U$70 U$72 U$74 U$76 U$78 U$80 U$82 U$84 U$86 U$88 U$90 U$92 U$94 U$97 U$98 U$100 U$102 U$104 U$106 U$108 U$110 U$112 U$114 U$116 U$130 = 100nF:100NF_DEVICE
U$12 = 330uF:330UF_DEVICE
U$18 = usb_B_ver_2:USB_NORM_VER2_DEV
U$19 = diode:DIODE_DEVICE
U$20 = ch340C:CH340C_DEVICE
U$22 U$23 = 3PIN:3PIN_DEVICE
U$24 U$25 U$28 U$31 U$34 = 10kOhm:10K_DEVICE
U$26 = button:BUTTON_DEVICE
U$27 = PowerSource-HighCurrent:POWER
U$29 U$30 = PCA9685:PCA9685
U$32 U$33 U$38 U$41 U$45 U$49 U$53 U$57 U$61 U$65 U$69 U$73 U$77 U$81 U$85 U$89 U$93 = 10uF:10UF_DEVICE
U$35 U$36 U$43 U$47 U$51 U$55 U$59 U$63 U$67 U$71 U$75 U$79 U$83 U$87 U$91 = TB6612FNG,C,8,EL_MotorDriver:TB6612FNG
U$95 U$96 U$99 U$101 U$103 U$105 U$107 U$109 U$111 U$113 = pressureSensor:ABPDANN1.6BGSA
U$115 = pca9555_jun:TSSOP-24_L7.8-W4.4-P0.65-LS652
U$117 U$118 = xt60pw:XT60_DEVICE
U$119 U$120 = zero_ohm:ZERO_OHM
U$121-U$123 = 2x10PIN:PHB-2-10
U$124 U$125 = led:LED
U$126 U$127 = 510_ohm:510_OHM_DEVICE
U$128 U$129 = 4k7:4K7